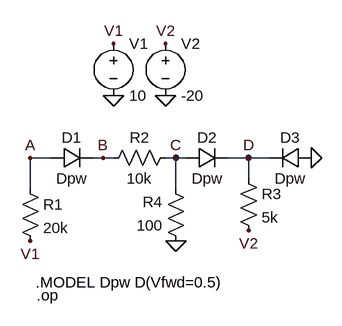
[diagram p0: schematic 8-2-11-a-1.asc]
8-2-11-a-1.asc, the LTspice schematic file:
Version 4
SHEET 1 880 680
WIRE 16 192 -16 192
WIRE 96 192 80 192
WIRE 112 192 96 192
WIRE 208 192 192 192
WIRE 224 192 208 192
WIRE 320 192 288 192
WIRE 352 192 320 192
WIRE 320 224 320 192
WIRE -16 240 -16 192
WIRE 208 240 208 192
FLAG 416 192 0
FLAG 112 16 V1
FLAG 192 16 V2
FLAG -16 320 V1
FLAG 320 304 V2
FLAG 112 96 0
FLAG 192 96 0
FLAG -16 192 A
FLAG 96 192 B
FLAG 320 192 D
FLAG 208 320 0
FLAG 208 192 C
SYMBOL res -32 224 R0
SYMATTR InstName R1
SYMATTR Value 20k
SYMBOL res 304 208 R0
SYMATTR InstName R3
SYMATTR Value 5k
SYMBOL diode 16 208 R270
WINDOW 0 32 32 VTop 2
WINDOW 3 0 32 VBottom 2
SYMATTR InstName D1
SYMATTR Value Dpw
SYMBOL diode 224 208 R270
WINDOW 0 32 32 VTop 2
WINDOW 3 0 32 VBottom 2
SYMATTR InstName D2
SYMATTR Value Dpw
SYMBOL diode 416 176 R90
WINDOW 0 0 32 VBottom 2
WINDOW 3 32 32 VTop 2
SYMATTR InstName D3
SYMATTR Value Dpw
SYMBOL voltage 112 0 R0
WINDOW 123 0 0 Left 0
WINDOW 39 0 0 Left 0
SYMATTR InstName V1
SYMATTR Value 10
SYMBOL voltage 192 0 R0
WINDOW 123 0 0 Left 0
WINDOW 39 0 0 Left 0
SYMATTR InstName V2
SYMATTR Value -20
SYMBOL res 208 176 R90
WINDOW 0 0 56 VBottom 2
WINDOW 3 32 56 VTop 2
SYMATTR InstName R2
SYMATTR Value 10k
SYMBOL res 224 336 R180
WINDOW 0 36 76 Left 2
WINDOW 3 36 40 Left 2
SYMATTR InstName R4
SYMATTR Value 100
TEXT -8 384 Left 2 !.MODEL Dpw D(Vfwd=0.5)
TEXT -6 404 Left 2 !.op

The netlist it stands for:
* 8-2-11-a-1.asc
R1 A V1 20k
R3 D V2 5k
D1 A B Dpw
D2 C D Dpw
D3 0 D Dpw
V1 V1 0 10
V2 V2 0 -20
R2 C B 10k
R4 0 C 100
.model D D
.lib standard.dio
.MODEL Dpw D(Vfwd=0.5)
.op
.backanno
.end

* Results of the author's LTspice run, read from the files saved beside the schematic
* Operating Point:
*   V(a) = 3.667 V
*   V(v1) = 10 V
*   V(d) = -500 mV
*   V(v2) = -20 V
*   V(b) = 3.167 V
*   V(c) = -3.267 µV
*   I(D3) = 3.583 mA
*   I(D2) = 316.7 µA
*   I(D1) = 316.7 µA
*   I(R4) = 32.67 nA
*   I(R2) = -316.7 µA
*   I(R3) = 3.9 mA
*   I(R1) = -316.7 µA
*   I(V2) = 3.9 mA
*   I(V1) = -316.7 µA